# Altium schematic sheet MOSFET_BANK.SchDoc
size C; SheetNumber: 2; SheetTotal: 9
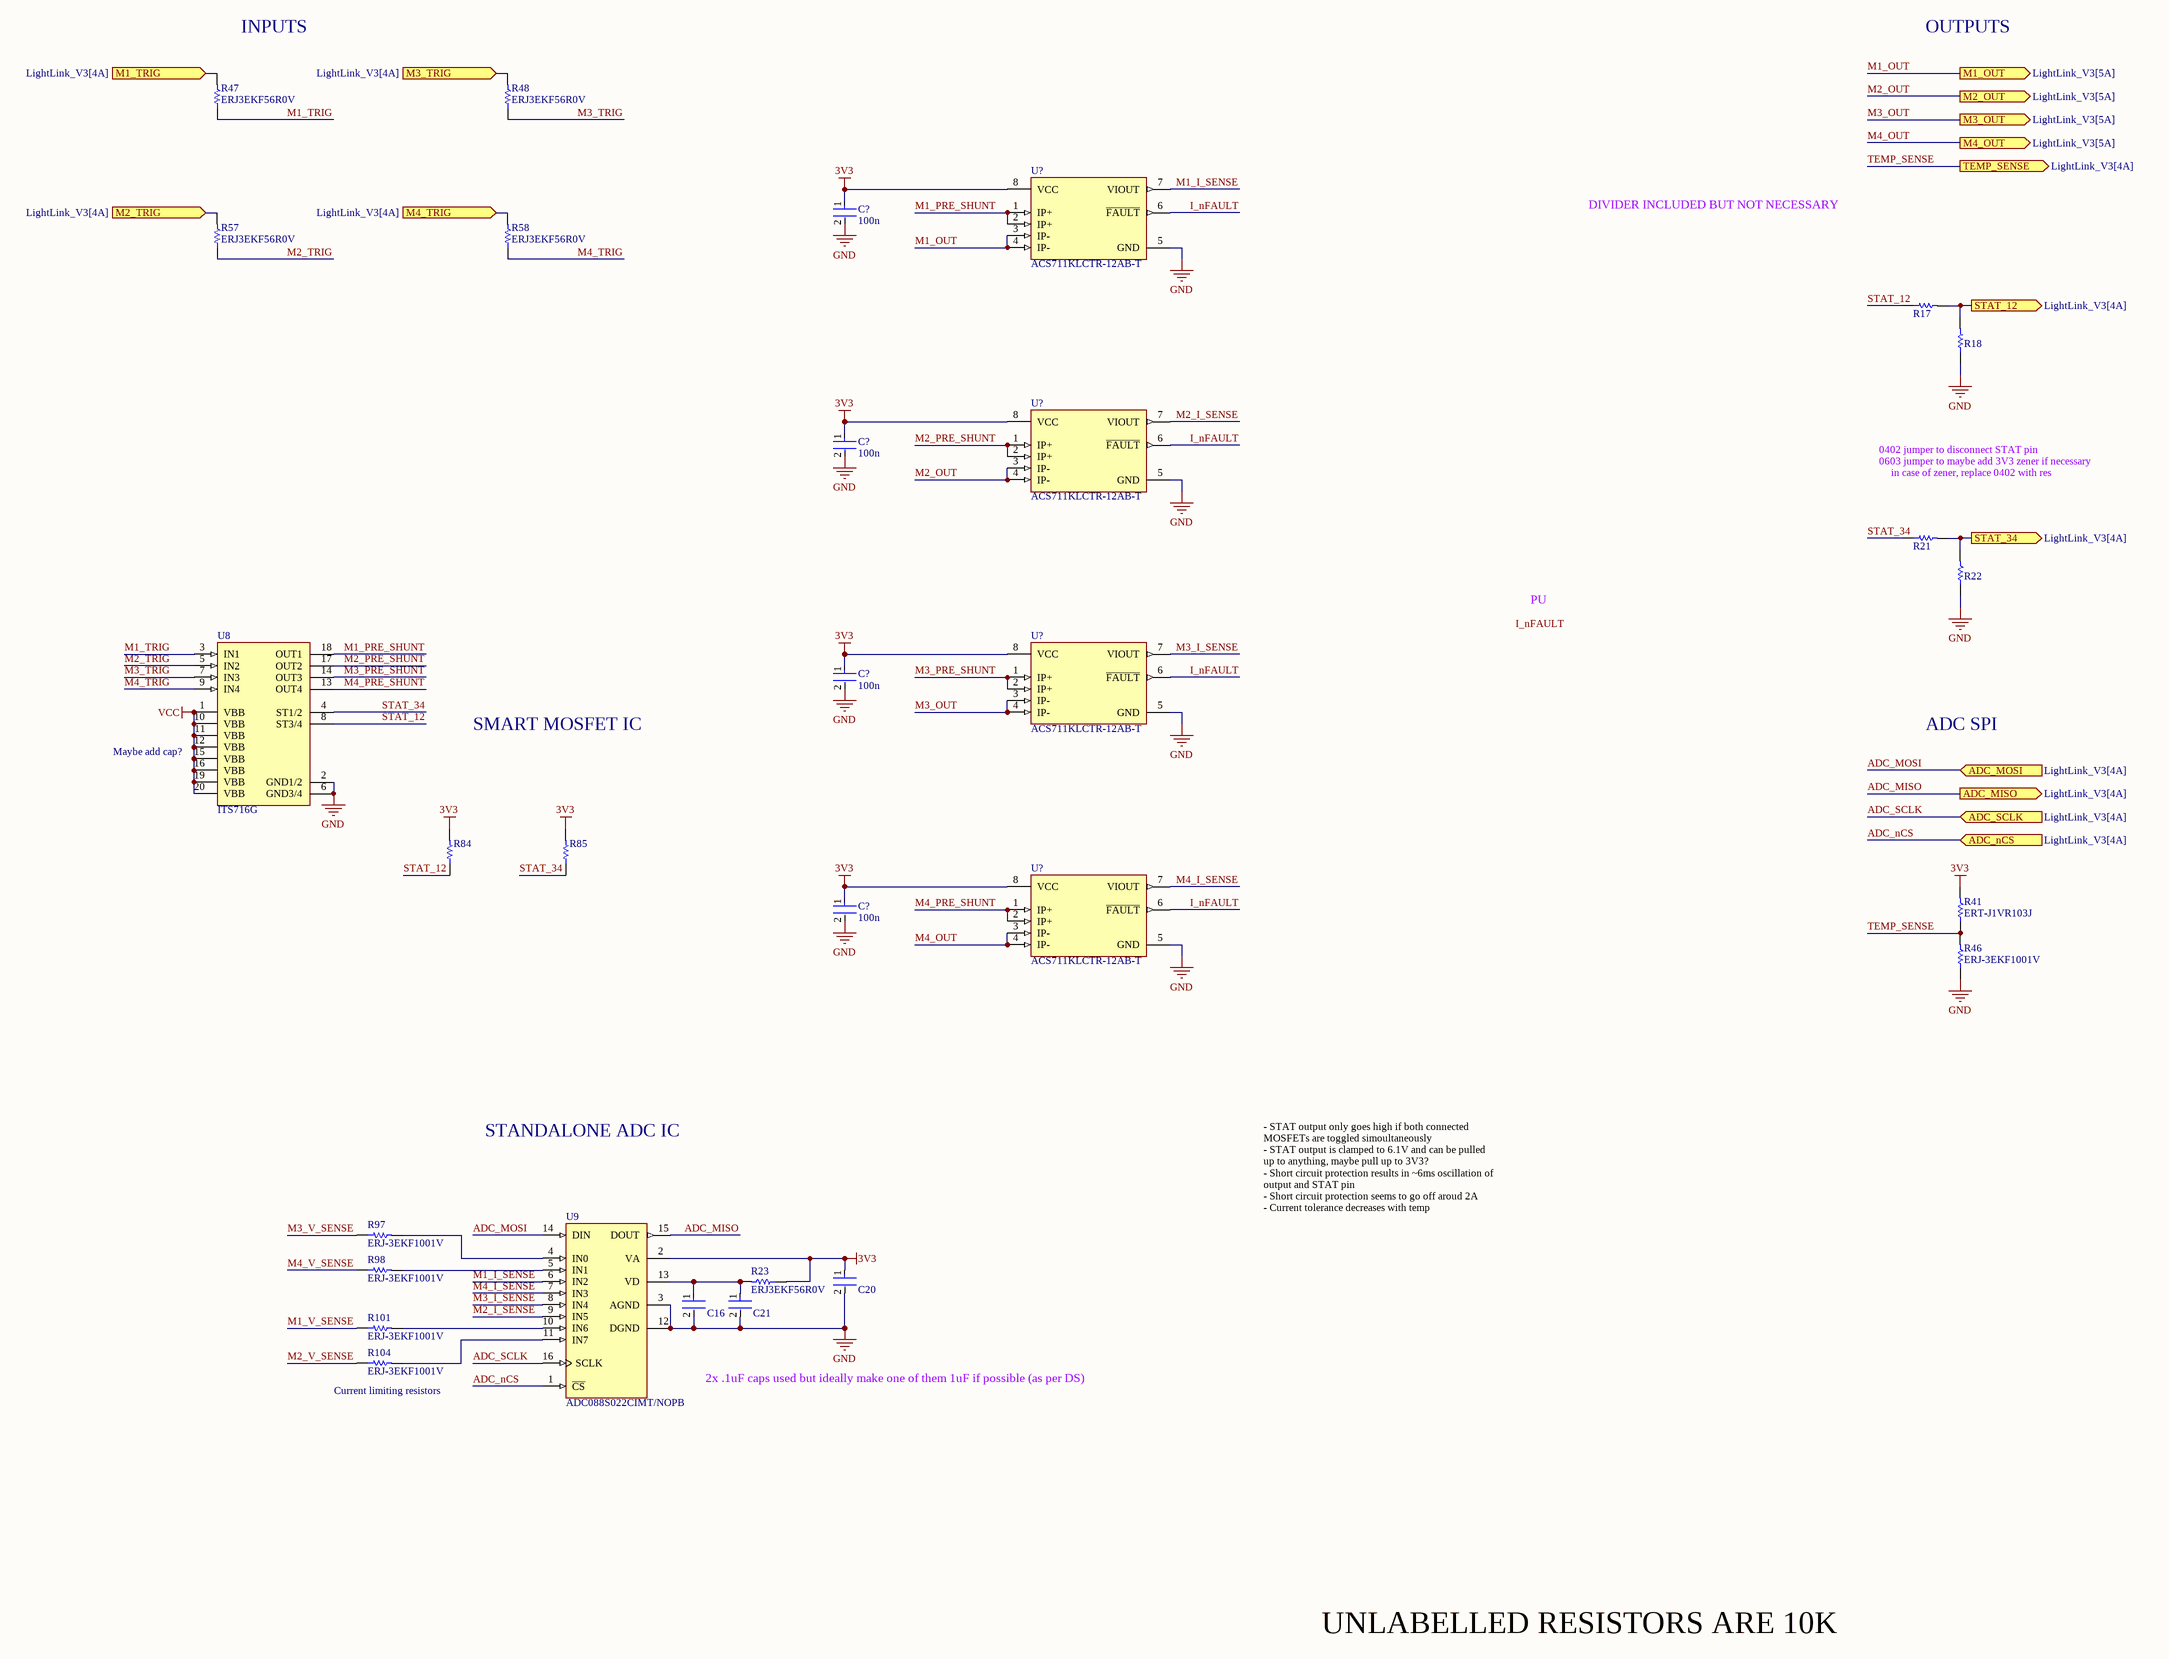
[diagram p0: MOSFET_BANK.SchDoc]

## Parts
(Parts that share a designator on the sheet are numbered #1, #2 ... from top to bottom, then left to right.)
C16  C0402C104K8PACTU  [FP-C0402-BB-MFG]  (value not drawn)
C20  C0402C104K8PACTU  [FP-C0402-BB-MFG]  (value not drawn)
C21  C0402C104K8PACTU  [FP-C0402-BB-MFG]  (value not drawn)
C?#1  100n  [FP-0402-L_1_0_0_05-W_0_5-IPC_A]
C?#2  100n  [FP-0402-L_1_0_0_05-W_0_5-IPC_A]
C?#3  100n  [FP-0402-L_1_0_0_05-W_0_5-IPC_A]
C?#4  100n  [FP-0402-L_1_0_0_05-W_0_5-IPC_A]
R17  0402 JUMPER 0 OHM  [RESC1005X40X25NL05T05]  (value not drawn)
R18  0603 JUMPER  [RESC1609X55X30ML15T15]  (value not drawn)
R21  0402 JUMPER 0 OHM  [RESC1005X40X25NL05T05]  (value not drawn)
R22  0603 JUMPER  [RESC1609X55X30ML15T15]  (value not drawn)
R23  ERJ3EKF56R0V  [RESC1608X55X30NL15T15]
R41  ERT-J1VR103J  [RESC1608X90X30ML15T20]
R46  ERJ-3EKF1001V  [RESC1608X55X30LL15T15]
R47  ERJ3EKF56R0V  [RESC1608X55X30NL15T15]
R48  ERJ3EKF56R0V  [RESC1608X55X30NL15T15]
R57  ERJ3EKF56R0V  [RESC1608X55X30NL15T15]
R58  ERJ3EKF56R0V  [RESC1608X55X30NL15T15]
R84  ERJ3EKF1002V  [RESC1609X55X30LL15T15]  (value not drawn)
R85  ERJ3EKF1002V  [RESC1609X55X30LL15T15]  (value not drawn)
R97  ERJ-3EKF1001V  [RESC1608X55X30LL15T15]
R98  ERJ-3EKF1001V  [RESC1608X55X30LL15T15]
R101  ERJ-3EKF1001V  [RESC1608X55X30LL15T15]
R104  ERJ-3EKF1001V  [RESC1608X55X30LL15T15]
U8  ITS716G  [INF-PG-DSO-20-32_L]
U9  ADC088S022CIMT/NOPB  [MTC16_L]
U?#1  ACS711KLCTR-12AB-T  [FP-LC-8-IPC_C]
U?#2  ACS711KLCTR-12AB-T  [FP-LC-8-IPC_C]
U?#3  ACS711KLCTR-12AB-T  [FP-LC-8-IPC_C]
U?#4  ACS711KLCTR-12AB-T  [FP-LC-8-IPC_C]

## Ports
ADC_MISO (out, see LightLink_V3[4A]), ADC_MOSI (in, see LightLink_V3[4A]), ADC_nCS (in, see LightLink_V3[4A]), ADC_SCLK (in, see LightLink_V3[4A]), M1_OUT (out, see LightLink_V3[5A]), M1_TRIG (in, see LightLink_V3[4A]), M2_OUT (out, see LightLink_V3[5A]), M2_TRIG (in, see LightLink_V3[4A]), M3_OUT (out, see LightLink_V3[5A]), M3_TRIG (in, see LightLink_V3[4A]), M4_OUT (out, see LightLink_V3[5A]), M4_TRIG (in, see LightLink_V3[4A]), STAT_12 (out, see LightLink_V3[4A]), STAT_34 (out, see LightLink_V3[4A]), TEMP_SENSE (out, see LightLink_V3[4A])

## Nets
3V3: C20.1 C?#1.1 C?#2.1 C?#3.1 C?#4.1 R23.1 R41.2 R84.2 R85.2 U9.2(VA) U?#1.8(VCC) U?#2.8(VCC) U?#3.8(VCC) U?#4.8(VCC)
GND: C16.2 C20.2 C21.2 C?#1.2 C?#2.2 C?#3.2 C?#4.2 R18.1 R22.1 R46.1 U8.2(GND1/2) U8.6(GND3/4) U9.3(AGND) U9.12(DGND) U?#1.5(GND) U?#2.5(GND) U?#3.5(GND) U?#4.5(GND)
VCC: U8.1(VBB) U8.10(VBB) U8.11(VBB) U8.12(VBB) U8.15(VBB) U8.16(VBB) U8.19(VBB) U8.20(VBB)
ADC_MISO: U9.15(DOUT) ; port ADC_MISO
ADC_MOSI: U9.14(DIN) ; port ADC_MOSI
ADC_nCS: U9.1(~{CS}) ; port ADC_nCS
ADC_SCLK: U9.16(SCLK) ; port ADC_SCLK
I_nFAULT: U?#1.6(~{FAULT}) U?#2.6(~{FAULT}) U?#3.6(~{FAULT}) U?#4.6(~{FAULT})
M1_I_SENSE: U9.6(IN2) U?#1.7(VIOUT)
M1_OUT: U?#1.3(IP-) U?#1.4(IP-) ; port M1_OUT
M1_PRE_SHUNT: U8.18(OUT1) U?#1.1(IP+) U?#1.2(IP+)
M1_TRIG: R47.1 U8.3(IN1)
M1_TRIG: R47.2 ; port M1_TRIG  [a separate net that carries the same name]
M1_V_SENSE: R101.1
M2_I_SENSE: U9.9(IN5) U?#2.7(VIOUT)
M2_OUT: U?#2.3(IP-) U?#2.4(IP-) ; port M2_OUT
M2_PRE_SHUNT: U8.17(OUT2) U?#2.1(IP+) U?#2.2(IP+)
M2_TRIG: R57.1 U8.5(IN2)
M2_TRIG: R57.2 ; port M2_TRIG  [a separate net that carries the same name]
M2_V_SENSE: R104.1
M3_I_SENSE: U9.8(IN4) U?#3.7(VIOUT)
M3_OUT: U?#3.3(IP-) U?#3.4(IP-) ; port M3_OUT
M3_PRE_SHUNT: U8.14(OUT3) U?#3.1(IP+) U?#3.2(IP+)
M3_TRIG: R48.1 U8.7(IN3)
M3_TRIG: R48.2 ; port M3_TRIG  [a separate net that carries the same name]
M3_V_SENSE: R97.1
M4_I_SENSE: U9.7(IN3) U?#4.7(VIOUT)
M4_OUT: U?#4.3(IP-) U?#4.4(IP-) ; port M4_OUT
M4_PRE_SHUNT: U8.13(OUT4) U?#4.1(IP+) U?#4.2(IP+)
M4_TRIG: R58.1 U8.9(IN4)
M4_TRIG: R58.2 ; port M4_TRIG  [a separate net that carries the same name]
M4_V_SENSE: R98.1
STAT_12: R17.1 R84.1 U8.8(ST3/4)
STAT_12: R17.2 R18.2 ; port STAT_12  [a separate net that carries the same name]
STAT_34: R21.1 R85.1 U8.4(ST1/2)
STAT_34: R21.2 R22.2 ; port STAT_34  [a separate net that carries the same name]
TEMP_SENSE: R41.1 R46.2 ; port TEMP_SENSE
NetC16_1: C16.1 C21.1 R23.2 U9.13(VD)
NetR97_2: R97.2 U9.4(IN0)
NetR98_2: R98.2 U9.5(IN1)
NetR101_2: R101.2 U9.10(IN6)
NetR104_2: R104.2 U9.11(IN7)

## Notes on the sheet
- INPUTS
- OUTPUTS
- DIVIDER INCLUDED BUT NOT NECESSARY
- 0402 jumper to disconnect STAT pin
- 0603 jumper to maybe add 3V3 zener if necessary
- in case of zener, replace 0402 with res
- PU
- SMART MOSFET IC
- ADC SPI
- (near U8) Maybe add cap?
- STANDALONE ADC IC
- - STAT output only goes high if both connected MOSFETs are toggled simoultaneously
  - STAT output is clamped to 6.1V and can be pulled up to anything, maybe pull up to 3V3?
  - Short circuit protection results in ~6ms oscillation of output and STAT pin
  - Short circuit protection seems to go off aroud 2A
  - Current tolerance decreases with temp
- (near R104) Current limiting resistors
- 2x .1uF caps used but ideally make one of them 1uF if possible (as per DS)
- UNLABELLED RESISTORS ARE 10K
- Labels drawn without touching a wire or pin: I_nFAULT

## Library data of the parts
C16 C20 C21 = CMP-2008-02046-2: CAP CER 0.1UF 10V X5R 0402; Manufacturer: Kemet; Material: Ceramic; Capacitance: 0.10 μF; Temperature Coefficient: 15%; Tolerance: 0.1; Value: 0.10 μF; Package: C0402-BB; Temperature: -55°C to +125°C; ComponentLink2Description: Datasheet; Temperature Characteristic: X5R; Device Class L1: Passive Components; Height: 0.55mm; Lead Free: Yes; ComponentLink2URL: https://content.kemet.com/datasheets/KEM_C1002_X7R_SMD.pdf; Device Class L2: Capacitors; Temperature Range Low: -55°C; Temperature Range High: +125°C; RoHS: TRUE; Octopart: https://octopart.com/c0402c104k8pactu-kemet-140039; Automotive: No; Mouser Description: Capacitor 100 nF 10 VDC 0402; Category: Cap; Voltage Rating: 10 V; Digikey Description: CAP CER 0.1UF 10V X5R 0402; Ipc Land Pattern Name: CAPC10050X50; Device Class L3: Ceramic Capacitors; Manufacturer Part Number: C0402C104K8PACTU
C?#1-C?#4 = CMP-001-00058-1: LARGE PADS, 0402 CAP, CHANGE COMMENT TO MATCH REAL P/N; Capacitor Type: Ceramic; Min Operating Temperature: -55°C; Mounting Technology: Surface Mount; Pins: 2; Case/Package: 0402; RoHS Compliant: Yes; Max Operating Temperature: 85°C
R17 R21 = CMP-009-00206-2: READ THE NAME
R18 R22 = CMP-009-00209-1: READ THE NAME
R23 R47 R48 R57 R58 = CMP-2000-00572-1: Manufacturer: Panasonic; Part Number: ERJ3EKF56R0V
R41 = CMP-2000-00869-1: Manufacturer: Panasonic; Part Number: ERT-J1VR103J
R46 R97 R98 R101 R104 = CMP-2000-00180-1: Manufacturer: Panasonic; Part Number: ERJ-3EKF1001V
R84 R85 = CMP-1012-00623-3: Chip Resistor, 10 KOhm, +/- 1%, 0.1 W, -55 to 155 degC, 0603 (1608 Metric), RoHS, Tape and Reel; Manufacturer: Panasonic; Voltage Rating: 75V; Case\/Package: 0603; Power Rating: 100mW; Resistance: 10KOhm; Temperature Coefficient: 100ppm\/degreesC; Number of Pins: 2; Package Reference: 603; Depth: 0.8mm; Mount: SurfaceMount; Package Description: 2-Pin Surface Mount Device, Body 1.6 x 0.85 mm; Datasheet Version: 02/2017; Length: 1.6mm; Lead Free: LeadFree; Height: 0.45mm; Number of Terminations: 2; Max Power Dissipation: 100mW; Min Operating Temperature: -55degC; Datasheet URL: https://industrial.panasonic.com/cdbs/www-data/pdf/RDA0000/AOA0000C304.pdf; Termination: SMD/SMT; Case Code (Metric): 1608; Case Code (Imperial): 0603; Tolerance: 1%; Max Operating Temperature: 155degC; RoHSCompliant: true; Voltage Rating (DC): 75V; Radiation Hardening: No; Packaging: TapeandReel; Composition: ThickFilm; Mounting Technology: SurfaceMount; Manufacturer URL: http://www.panasonic.com/; Width: 0.031inch; REACH SVHC: NoSVHC; Contact Plating: Tin; Military Standard: Not; Package Quantity: 1
U8 = CMP-1095-00041-1: Smart High-Side Power Switch for Industrial Applications 4 Channels: 4 x 140 mOhm Status Feedback, 5.5 to 40 V Operating, -30 to 85 degC, PG-DSO-20-32, Reel, Green; Manufacturer: Infineon; Green: TRUE; Operating Voltage Range (max): 40 V; Operating Voltage Range (min): 5.5Â V; Ptot (max): 3.6Â W; Diagnostic: Digital; IL (nom)min - one channel active: 2.3Â A; RON (max) @ Tj max: 280 mOhm; RON @ 25 degC: 140 mOhm (max); IL (SC): 9 A; IL (nom)min - all channels active: 1.3Â A; toff (max): 270 us; Channels: 4; ton (max): 250 us; ComponentLink1Description: Manufacturer URL; Packing: Reel; ComponentLink3Description: Package Specification; ComponentLink1URL: http://www.infineon.com/; Halogen-free: available; Mounting Technology: Surface Mount; PartNumber: ITS716G; ComponentLink3URL: http://www.infineon.com/dgdl/BTS+4130QGA_DS10+_neu.pdf?folderId=db3a304314dca389011537739e37155f&fileId=db3a30431a5c32f2011a957932285680&sId=db3a30433d68e984013d7f42d6576278; PackageVersion: Mar-08; ComponentLink2Description: Datasheet; ComponentLink2URL: http://www.infineon.com/dgdl/ITS716G_DS11_20081002.pdf?folderId=db3a304412b407950112b408e8c90004&fileId=db3a304412b407950112b428c2cf3e6d; DatasheetVersion: Rev. 1.1; PackageDescription: 20-Pin Plastic (Green) Dual Small Outline Package, 12.7 x 7.5 mm Body, 1.27 mm Pitch; Load Current (typ): 1.3Â A; PackageReference: PG-DSO-20-32; IL (SCp): 9 A
U9 = CMP-0054-00372-2: 8-Channel, 50 kSPS to 200 kSPS, 8-Bit A/D Converter, 16-pin TSSOP, Pb-Free; Manufacturer: National Semiconductor; PackageTopMarking: NSUZXYTT*88S022*CIMT; CompType: ADC IC; PowerWise: Y; ComponentLink2URL: http://www.national.com/pf/AD/ADC088S022.html; RoHS: Y; PackageDescription: Molded TSSOP, Jedec, 5 x 4.4 x 0.9mm Body, 16 Lead, 0.65mm Pitch; DatasheetVersion: Feb-2010; PinCount: 16; ComponentLink1Description: ADC088S022 Datasheet; Code_JEDEC: MO-153-AB; ComponentLink3URL: http://www.national.com/packaging/folders/mtc16.html; PackageVersion: revD, Jun-2003; ComponentLink3Description: MTC16 Package Page; RevisionNote: Component URLs added; ComponentLink1URL: http://www.national.com/ds/AD/ADC088S022.pdf; ComponentLink2Description: ADC088S022 Web Page; PackageReference: MTC16
U?#1-U?#4 = CMP-1557-00012-2: SENSOR CURRENT HALL 12.5A AC/DC; Number of Channels: 1; Min Supply Voltage: 3V; Sensitivity: 110mV/A; Response Time: 4.6us; Operating Supply Voltage: 3.3V; Max Supply Voltage: 5.5V; Max Supply Current: 5.5mA; Bandwidth: 100kHz; Linearity: 1%; Quiescent Current: 4mA; Accuracy: 5%; Polarity: Bidirectional; Case/Package: SOIC; Packaging: Tape and Reel; Number of Pins: 8; Width: 3.9mm; Frequency: 100kHz; -3db Bandwidth: 100kHz; REACH SVHC: No SVHC; Series: -; Height: 1.5mm; Package Quantity: 1; Min Operating Temperature: -40°C; Max Operating Temperature: 125°C; Current Sensing: 12.5A; RoHS Compliant: Yes; Length: 4.9mm